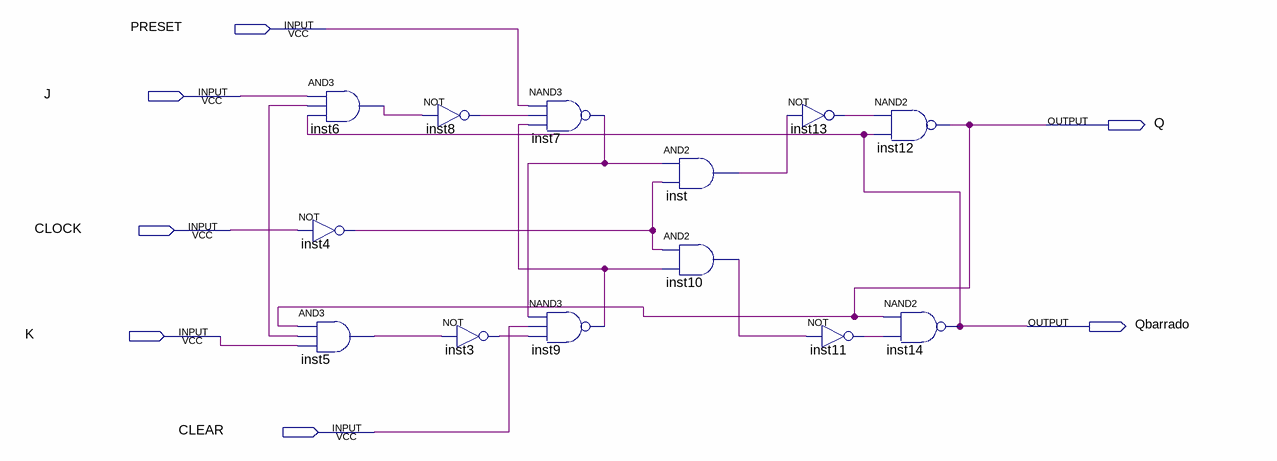
[diagram p0: schematic sheet]
// Quartus schematic relatorio1_esquematico.bdf as structural Verilog: 13 symbols, 7 pins
module relatorio1_esquematico (
  input  PRESET,
  input  J,
  input  CLOCK,
  input  K,
  input  CLEAR,
  output Q,
  output Qbarrado
);

  wire inst3_out, inst4_out, inst5_out, inst6_out, inst7_out, inst8_out, inst9_out, inst10_out, inst11_out,
       inst13_out, inst_out, undriven;

  and inst6 (inst6_out, J, undriven, Qbarrado);
  not inst4 (inst4_out, CLOCK);
  and inst5 (inst5_out, Q, undriven, K);
  not inst8 (inst8_out, inst6_out);
  not inst3 (inst3_out, inst5_out);
  nand inst7 (inst7_out, PRESET, inst8_out, inst9_out);
  nand inst9 (inst9_out, inst7_out, CLEAR, inst3_out);
  and inst (inst_out, inst7_out, inst4_out);
  and inst10 (inst10_out, inst4_out, inst9_out);
  not inst13 (inst13_out, inst_out);
  not inst11 (inst11_out, inst10_out);
  nand inst12 (Q, inst13_out, Qbarrado);
  nand inst14 (Qbarrado, Q, inst11_out);
endmodule
